# EAGLE schematic ds18b20 schematic phase 3 (EAGLE 7.5.0)
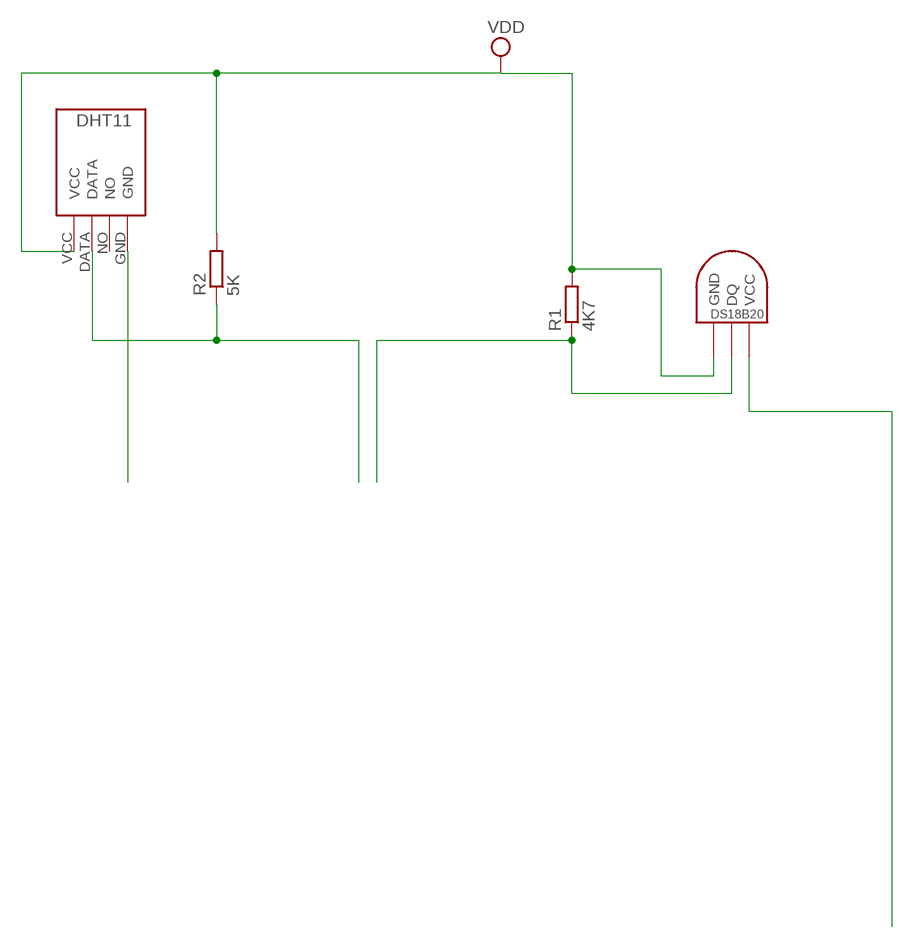
[diagram p0: schematic, sheet 1]

## Parts
R1  4K7  R-EU_0204/7  [0204/7]
R2  5K  R-EU_0204/7  [0204/7]
U$1  DS1820TO92  [DS1820]
U$2  DHT11-PION.  [DHT11-PION.]

## Nets
N$2: R2.1 U$2.DATA
N$3: U$2.GND
N$4: U$1.VDD(VCC)
N$6: R1.1 U$1.DQ
VDD: R1.2 R2.2 U$1.GND U$2.VCC
Unconnected: U$2.NO

## Library data of the parts
R1 R2 = resistor:R-EU_: RESISTOR, European symbol
U$1 = Ava:DS1820: DS18B20 Programmable Resolution 1-Wire Digital Thermometer Description The DS18B20 digital thermometer provides 9-bit to 12-bit Celsius temperature measurements and has an alarm function with nonvolatile user-programmable upper and lower trigger points. The DS18B20 communicates over a 1-Wire® bus that by definition requires only one data line (and ground) for communication with a central microprocessor. It has an operating temperature range of -55°C to +125°C and is accurate to ±0.5°C over the range of -10°C to +85°C. In addition, the DS18B20 can derive power directly from the data line ("parasite power"), eliminating the need for an external power supply. Each DS18B20 has a unique 64-bit serial code, which allows multiple DS18B20s to function on the same 1-Wire bus. Thus, it is simple to use one microprocessor to control many DS18B20s distributed over a large area. Applications that can benefit from this feature include HVAC environmental controls, temperature monitoring systems inside buildings, equipment, or machinery, and process monitoring and control systems.
U$2 = DHT11:DHT11-PION.: DHT11 Czujnik temperatury i wilgotności (widok pionowy)